# EAGLE schematic setup (EAGLE 7.7.0)
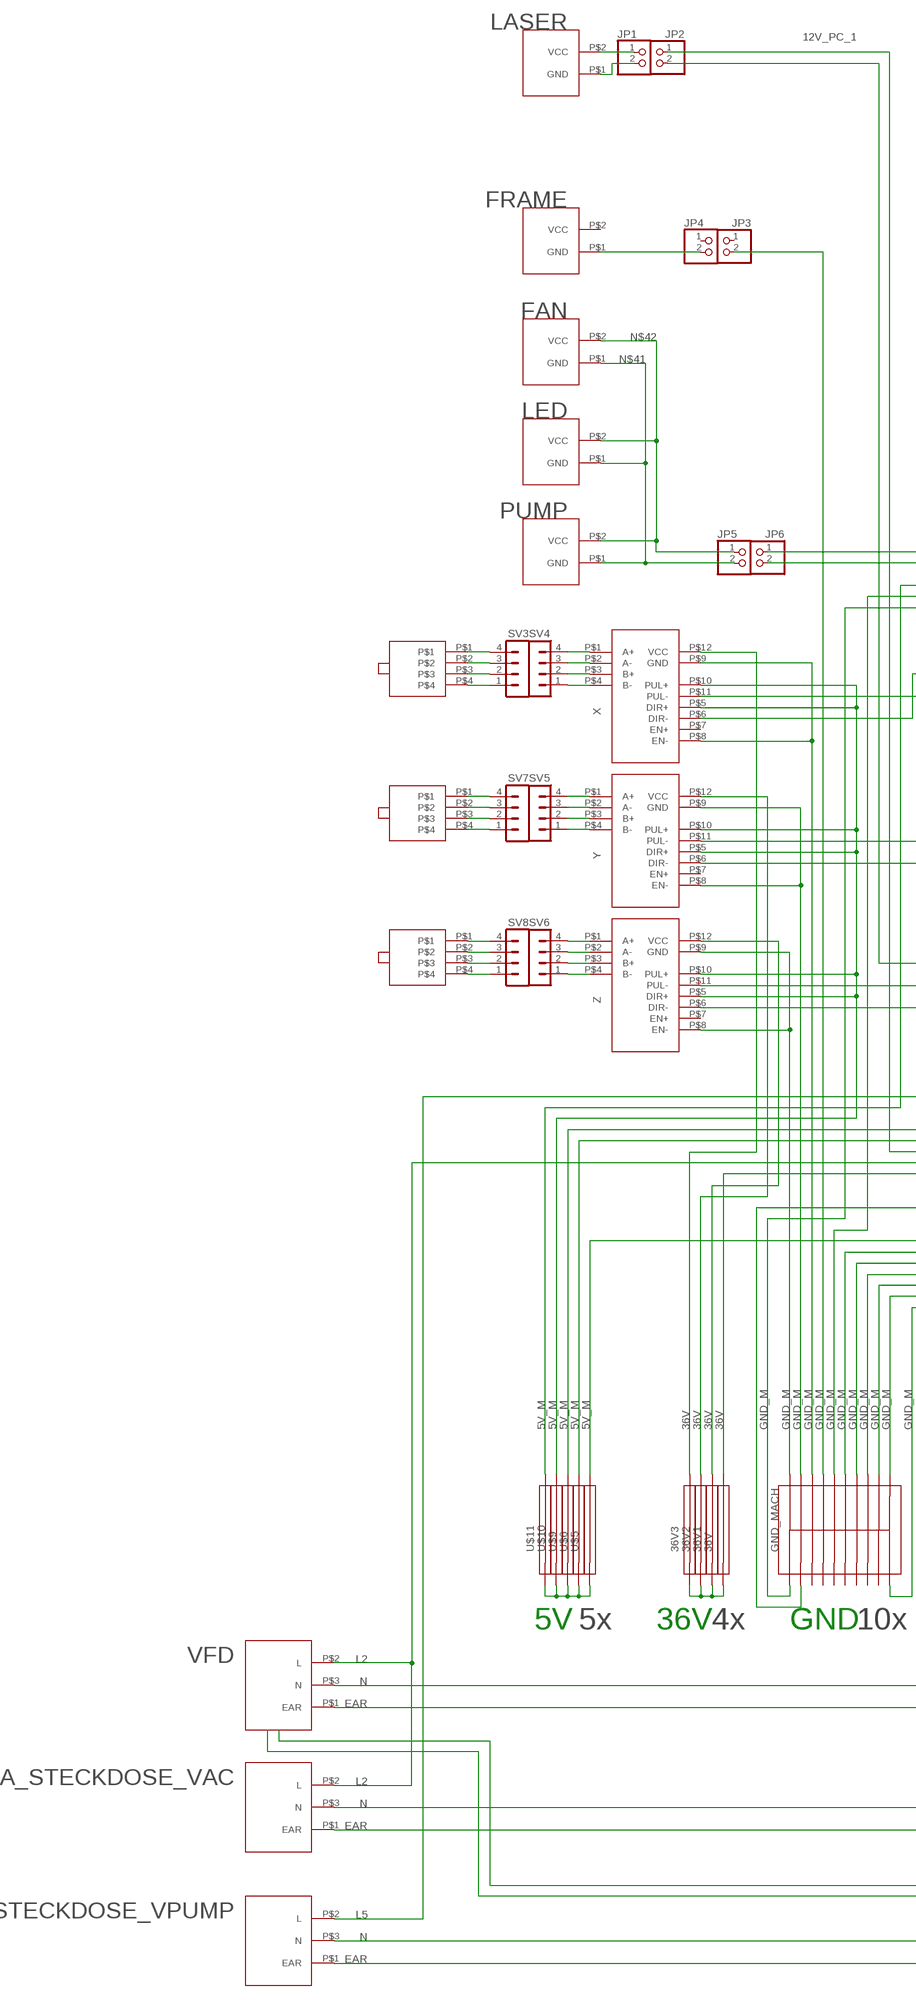
[diagram p0: schematic, sheet 1, part 1 of 3]
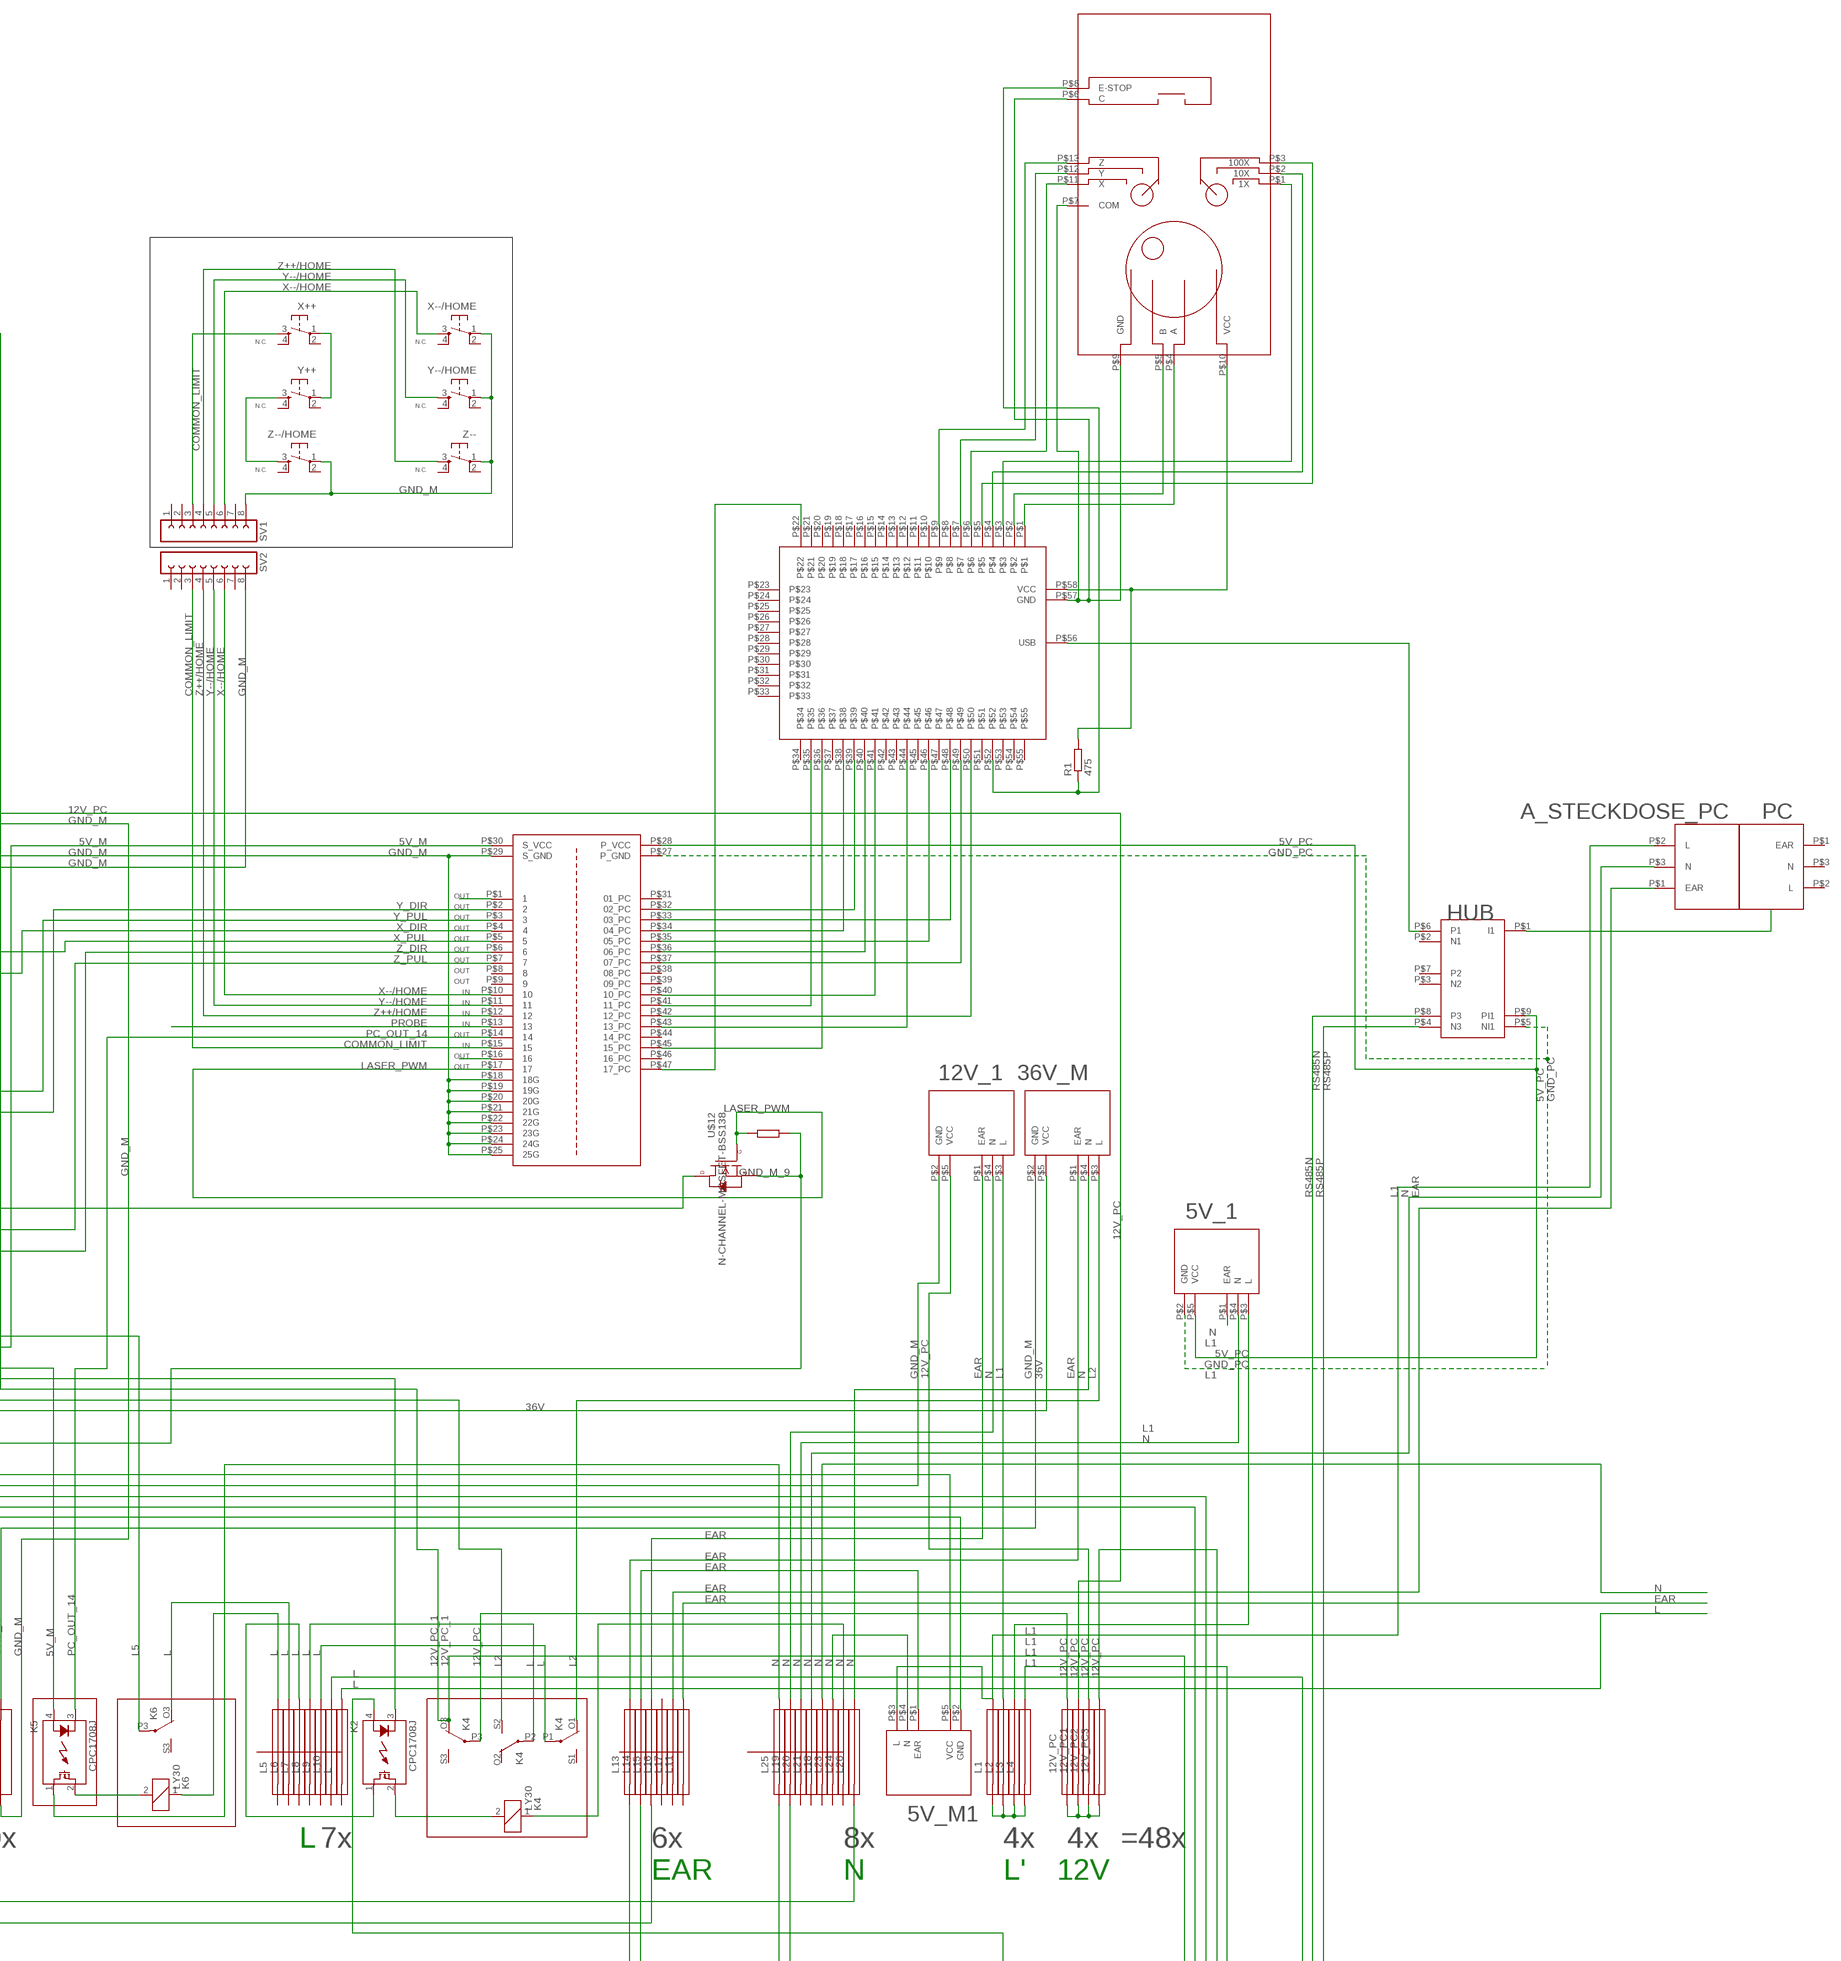
[diagram p1: schematic, sheet 1, part 2 of 3]
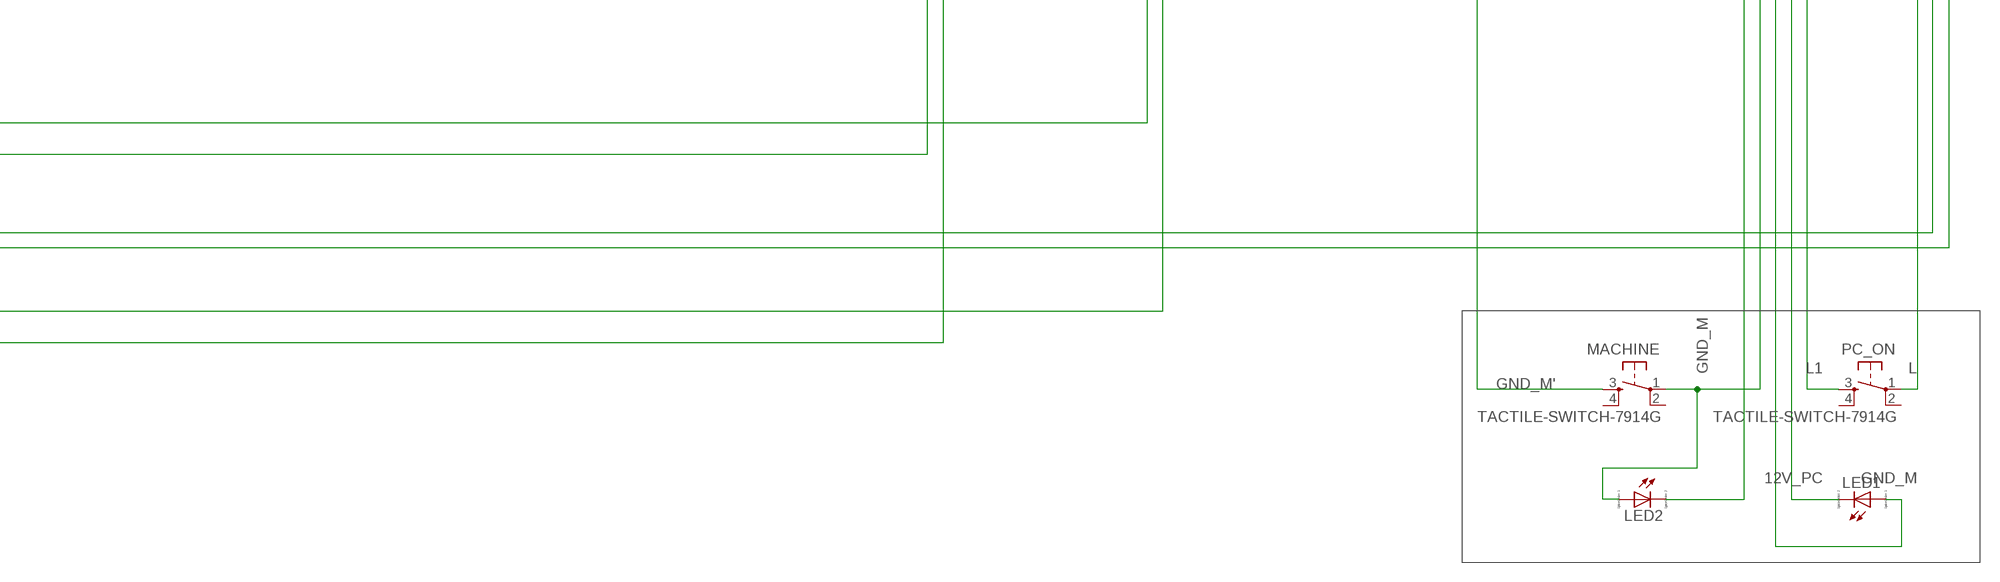
[diagram p2: schematic, sheet 1, part 3 of 3]

## Parts
5V_1  PWR  [PWR]
5V_M1  PWR  [PWR]
12V_1  PWR  [PWR]
12V_PC  SINGLE_CONNECTOR  [CONNECTOR]
12V_PC1  SINGLE_CONNECTOR  [CONNECTOR]
12V_PC2  SINGLE_CONNECTOR  [CONNECTOR]
12V_PC3  SINGLE_CONNECTOR  [CONNECTOR]
36V  SINGLE_CONNECTOR  [CONNECTOR]
36V1  SINGLE_CONNECTOR  [CONNECTOR]
36V2  SINGLE_CONNECTOR  [CONNECTOR]
36V3  SINGLE_CONNECTOR  [CONNECTOR]
36V_M  PWR  [PWR]
A_STECKDOSE_PC  230VDEV  [230V]
A_STECKDOSE_VAC  230VDEV  [230V]
A_STECKDOSE_VPUMP  230VDEV  [230V]
FAN  LV_DEV  [PUMP]
FRAME  LV_DEV  [PUMP]
GND_MACH  CONNECTOR  [CONNECTOR]
JP1  PINHD-1X2  [1X02]
JP2  PINHD-1X2  [1X02]
JP3  PINHD-1X2  [1X02]
JP4  PINHD-1X2  [1X02]
JP5  PINHD-1X2  [1X02]
JP6  PINHD-1X2  [1X02]
K2  CPC1708J  [I4-PAC]
K4  LY30  [LY30]
K5  CPC1708J  [I4-PAC]
K6  LY30  [LY30]
L  SINGLE_CONNECTOR  [CONNECTOR]
L1  SINGLE_CONNECTOR  [CONNECTOR]
L2  SINGLE_CONNECTOR  [CONNECTOR]
L3  SINGLE_CONNECTOR  [CONNECTOR]
L4  SINGLE_CONNECTOR  [CONNECTOR]
L5  SINGLE_CONNECTOR  [CONNECTOR]
L6  SINGLE_CONNECTOR  [CONNECTOR]
L7  SINGLE_CONNECTOR  [CONNECTOR]
L8  SINGLE_CONNECTOR  [CONNECTOR]
L9  SINGLE_CONNECTOR  [CONNECTOR]
L10  SINGLE_CONNECTOR  [CONNECTOR]
L11  SINGLE_CONNECTOR  [CONNECTOR]
L13  SINGLE_CONNECTOR  [CONNECTOR]
L14  SINGLE_CONNECTOR  [CONNECTOR]
L15  SINGLE_CONNECTOR  [CONNECTOR]
L16  SINGLE_CONNECTOR  [CONNECTOR]
L17  SINGLE_CONNECTOR  [CONNECTOR]
L18  SINGLE_CONNECTOR  [CONNECTOR]
L19  SINGLE_CONNECTOR  [CONNECTOR]
L20  SINGLE_CONNECTOR  [CONNECTOR]
L21  SINGLE_CONNECTOR  [CONNECTOR]
L23  SINGLE_CONNECTOR  [CONNECTOR]
L24  SINGLE_CONNECTOR  [CONNECTOR]
L25  SINGLE_CONNECTOR  [CONNECTOR]
L26  SINGLE_CONNECTOR  [CONNECTOR]
LASER  LV_DEV  [PUMP]
LED  LV_DEV  [PUMP]
LED1  LED_E  [LED_1206]
LED2  LED_E  [LED_1206]
MACHINE  TACTILE-SWITCH-7914G  [7914G]
PC  230VDEV  [230V]
PC_ON  TACTILE-SWITCH-7914G  [7914G]
PUMP  LV_DEV  [PUMP]
R1  475  R-EU_0204/2V  [0204V]
SV1  FE08-1  [FE08]
SV2  FE08-1  [FE08]
SV3  MA04-1  [MA04-1]
SV4  MA04-1  [MA04-1]
SV5  MA04-1  [MA04-1]
SV6  MA04-1  [MA04-1]
SV7  MA04-1  [MA04-1]
SV8  MA04-1  [MA04-1]
U$1  BOB  [BOB]
U$2  HUB  [HUB]
U$3  MOTOR  [MOTOR]
U$4  POKEY57U  [POKEY57U]
U$5  SINGLE_CONNECTOR  [CONNECTOR]
U$6  SINGLE_CONNECTOR  [CONNECTOR]
U$7  MOTOR  [MOTOR]
U$8  MOTOR  [MOTOR]
U$9  SINGLE_CONNECTOR  [CONNECTOR]
U$10  SINGLE_CONNECTOR  [CONNECTOR]
U$11  SINGLE_CONNECTOR  [CONNECTOR]
U$12  N-CHANNEL-MOSFET-BSS138  [SOT23-3]
U$13  PENDANT  [PENDANT]
VFD  230VDEV  [230V]
X  DRIVER  [DRIVER]
X++  TACTILE-SWITCH-7914G  [7914G]
X--/HOME  TACTILE-SWITCH-7914G  [7914G]
Y  DRIVER  [DRIVER]
Y++  TACTILE-SWITCH-7914G  [7914G]
Y--/HOME  TACTILE-SWITCH-7914G  [7914G]
Z  DRIVER  [DRIVER]
Z--  TACTILE-SWITCH-7914G  [7914G]
Z--/HOME  TACTILE-SWITCH-7914G  [7914G]

## Nets
5V_M: 5V_M1.P$5(VCC) K2.3(K) K5.4(A) U$1.P$30(S_VCC) U$5.P$2 U$6.P$2 U$9.P$2 U$10.P$2 U$11.P$2 X.P$5(DIR+) X.P$10(PUL+) Y.P$5(DIR+) Y.P$10(PUL+) Z.P$5(DIR+) Z.P$10(PUL+)
5V_PC: 5V_1.P$5(VCC) U$1.P$28(P_VCC) U$2.P$6(P1) U$2.P$9(PI1) U$4.P$56(USB)
12V_PC: 12V_1.P$5(VCC) 12V_PC1.P$2 12V_PC2.P$2 12V_PC3.P$2 12V_PC.P$2 JP6.1 K4.P3(4:P) LED1.C
12V_PC_1: JP2.1 K4.O3(4:O) LED2.C
36V: 36V1.P$2 36V2.P$2 36V3.P$2 36V.P$2 36V_M.P$5(VCC) X.P$12(VCC) Y.P$12(VCC) Z.P$12(VCC)
COMMON_LIMIT: SV1.3 SV2.3 U$1.P$15 X++.3
EAR: 5V_M1.P$1(EAR) 12V_1.P$1(EAR) 36V_M.P$1(EAR) A_STECKDOSE_PC.P$1(EAR) A_STECKDOSE_VAC.P$1(EAR) A_STECKDOSE_VPUMP.P$1(EAR) L11.P$2 L13.P$1 L13.P$2 L14.P$1 L14.P$2 L15.P$1 L15.P$2 L17.P$2 VFD.P$1(EAR)
GND_M: 5V_M1.P$2(GND) 12V_1.P$2(GND) 36V_M.P$2(GND) GND_MACH.P$1 GND_MACH.P$10 GND_MACH.P$11 GND_MACH.P$12 GND_MACH.P$13 GND_MACH.P$14 GND_MACH.P$15 GND_MACH.P$16 GND_MACH.P$17 GND_MACH.P$18 GND_MACH.P$19 GND_MACH.P$20 JP3.2 JP6.2 LED1.A LED2.A MACHINE.1 SV1.8 SV2.8 U$1.P$18(18G) U$1.P$19(19G) U$1.P$20(20G) U$1.P$21(21G) U$1.P$22(22G) U$1.P$23(23G) U$1.P$24(24G) U$1.P$25(25G) U$1.P$29(S_GND) X--/HOME.1 X.P$8(EN-) X.P$9(GND) Y--/HOME.1 Y.P$8(EN-) Y.P$9(GND) Z--.1 Z--/HOME.1 Z.P$8(EN-) Z.P$9(GND)
GND_M': K2.4(A) MACHINE.3
GND_M_9: GND_MACH.P$2 U$12.2(S)
GND_PC: 5V_1.P$2(GND) U$1.P$27(P_GND) U$2.P$5(NI1)
L: K2.1(DS1) K4.P1(2:P) K4.P2(3:P) K6.1 K6.O3(4:O) L5.P$2 L6.P$2 L7.P$2 L8.P$2 L9.P$2 L10.P$2 L.P$2 PC_ON.1
L1: 5V_1.P$3(L) 5V_M1.P$3(L) 12V_1.P$3(L) A_STECKDOSE_PC.P$2(L) L1.P$2 L2.P$2 L3.P$2 L4.P$2 PC_ON.3
L2: 36V_M.P$3(L) A_STECKDOSE_VAC.P$2(L) K4.O1(2:O) K4.S2(3:S) VFD.P$2(L)
L5: A_STECKDOSE_VPUMP.P$2(L) K6.P3(4:P)
LASER_PWM: U$1.P$17 U$12.1(G)
N: 5V_1.P$4(N) 5V_M1.P$4(N) 12V_1.P$4(N) 36V_M.P$4(N) A_STECKDOSE_PC.P$3(N) A_STECKDOSE_VAC.P$3(N) A_STECKDOSE_VPUMP.P$3(N) K4.1 K5.1(DS1) L18.P$2 L19.P$1 L19.P$2 L20.P$2 L21.P$2 L23.P$2 L24.P$2 L25.P$1 L25.P$2 L26.P$1 L26.P$2 VFD.P$3(N)
N$1: SV3.4 U$3.P$1
N$2: SV3.3 U$3.P$2
N$3: SV3.2 U$3.P$3
N$4: SV3.1 U$3.P$4
N$5: SV7.4 U$7.P$1
N$6: SV7.3 U$7.P$2
N$7: SV7.2 U$7.P$3
N$8: SV8.4 U$8.P$1
N$9: SV8.3 U$8.P$2
N$10: SV8.2 U$8.P$3
N$11: SV8.1 U$8.P$4
N$12: SV7.1 U$7.P$4
N$13: U$1.P$1
N$14: U$1.P$16
N$15: U$1.P$33(03_PC) U$4.P$48
N$16: JP2.2 U$12.3(D)
N$17: U$1.P$40(10_PC) U$4.P$41
N$18: X++.1 Y++.1
N$19: U$1.P$47(17_PC) U$4.P$22
N$20: U$1.P$32(02_PC) U$4.P$39
N$21: U$2.P$1(I1)
N$22: Y++.3 Z--/HOME.3
N$23: U$1.P$34(04_PC) U$4.P$38
N$24: U$1.P$35(05_PC) U$4.P$46
N$25: SV4.4 X.P$1(A+)
N$26: SV4.3 X.P$2(A-)
N$27: U$1.P$36(06_PC) U$4.P$40
N$28: SV4.2 X.P$3(B+)
N$29: SV4.1 X.P$4(B-)
N$30: SV5.4 Y.P$1(A+)
N$31: SV5.3 Y.P$2(A-)
N$32: SV5.2 Y.P$3(B+)
N$33: SV5.1 Y.P$4(B-)
N$34: SV6.4 Z.P$1(A+)
N$35: SV6.3 Z.P$2(A-)
N$36: SV6.2 Z.P$3(B+)
N$37: SV6.1 Z.P$4(B-)
N$38: JP1.2 LASER.P$1(GND)
N$39: JP1.1 LASER.P$2(VCC)
N$40: FRAME.P$1(GND) JP4.2
N$41: FAN.P$1(GND) JP5.2 LED.P$1(GND) PUMP.P$1(GND)
N$42: FAN.P$2(VCC) JP5.1 LED.P$2(VCC) PUMP.P$2(VCC)
N$43: K5.2(DS2) K6.2
N$44: 5V_1.P$1(EAR)
N$45: U$1.P$37(07_PC) U$4.P$49
N$46: K2.2(DS2) K4.2
N$47: 12V_PC1.P$1 12V_PC2.P$1 12V_PC3.P$1 12V_PC.P$1
N$48: U$4.P$57(GND) U$13.P$6(C) U$13.P$7(COM) U$13.P$9(GND)
N$49: L1.P$1 L2.P$1 L3.P$1 L4.P$1
N$50: 36V1.P$1 36V2.P$1 36V3.P$1 36V.P$1
N$51: R1.2 U$4.P$58(VCC) U$13.P$10(VCC)
N$52: U$4.P$1 U$13.P$4(A)
N$53: U$4.P$2 U$13.P$5(B)
N$54: U$4.P$5 U$13.P$3(100X)
N$55: U$4.P$4 U$13.P$2(10X)
N$56: U$4.P$3 U$13.P$1(1X)
N$57: U$5.P$1 U$6.P$1 U$9.P$1 U$10.P$1 U$11.P$1
N$58: U$1.P$41(11_PC) U$4.P$35
N$59: U$1.P$42(12_PC) U$4.P$50
N$60: U$1.P$43(13_PC) U$4.P$44
N$61: U$1.P$45(15_PC) U$4.P$36
N$64: U$4.P$6 U$13.P$11(X)
N$65: U$4.P$7 U$13.P$12(Y)
N$66: U$4.P$9 U$13.P$13(Z)
N$68: R1.1 U$4.P$52 U$13.P$8(E-STOP)
PC_OUT_14: K5.3(K) U$1.P$14
PROBE: U$1.P$13
RS485N: U$2.P$8(P3)
RS485P: U$2.P$4(N3)
X--/HOME: SV1.6 SV2.6 U$1.P$10 X--/HOME.3
X_DIR: U$1.P$4 X.P$6(DIR-)
X_PUL: U$1.P$5 X.P$11(PUL-)
Y--/HOME: SV1.5 SV2.5 U$1.P$11 Y--/HOME.3
Y_DIR: U$1.P$2 Y.P$6(DIR-)
Y_PUL: U$1.P$3 Y.P$11(PUL-)
Z++/HOME: SV1.4 SV2.4 U$1.P$12 Z--.3
Z_DIR: U$1.P$6 Z.P$6(DIR-)
Z_PUL: U$1.P$7 Z.P$11(PUL-)
Unconnected: FRAME.P$2(VCC) GND_MACH.P$3 GND_MACH.P$4 GND_MACH.P$5 GND_MACH.P$6 GND_MACH.P$7 GND_MACH.P$8 GND_MACH.P$9 JP3.1 JP4.1 K4.O2(3:O) K4.S1(2:S) K4.S3(4:S) K6.O1(2:O) K6.O2(3:O) K6.P1(2:P) K6.P2(3:P) K6.S1(2:S) K6.S2(3:S) K6.S3(4:S) L5.P$1 L6.P$1 L7.P$1 L8.P$1 L9.P$1 L10.P$1 L11.P$1 L16.P$1 L16.P$2 L17.P$1 L18.P$1 L20.P$1 L21.P$1 L23.P$1 L24.P$1 L.P$1 MACHINE.2 MACHINE.4 PC.P$1(EAR) PC.P$2(L) PC.P$3(N) PC_ON.2 PC_ON.4 SV1.1 SV1.2 SV1.7 SV2.1 SV2.2 SV2.7 U$1.P$8 U$1.P$9 U$1.P$31(01_PC) U$1.P$38(08_PC) U$1.P$39(09_PC) U$1.P$44(14_PC) U$1.P$46(16_PC) U$2.P$2(N1) U$2.P$3(N2) U$2.P$7(P2) U$4.P$8 U$4.P$10 U$4.P$11 U$4.P$12 U$4.P$13 U$4.P$14 U$4.P$15 U$4.P$16 U$4.P$17 U$4.P$18 U$4.P$19 U$4.P$20 U$4.P$21 U$4.P$23 U$4.P$24 U$4.P$25 U$4.P$26 U$4.P$27 U$4.P$28 U$4.P$29 U$4.P$30 U$4.P$31 U$4.P$32 U$4.P$33 U$4.P$34 U$4.P$37 U$4.P$42 U$4.P$43 U$4.P$45 U$4.P$47 U$4.P$51 U$4.P$53 U$4.P$54 U$4.P$55 X++.2 X++.4 X--/HOME.2 X--/HOME.4 X.P$7(EN+) Y++.2 Y++.4 Y--/HOME.2 Y--/HOME.4 Y.P$7(EN+) Z--.2 Z--.4 Z--/HOME.2 Z--/HOME.4 Z.P$7(EN+)

## Notes on the sheet
- N.C. | N.C.
- N.C. | N.C.
- N.C. | N.C.
- OUT
- OUT
- OUT
- OUT
- OUT
- OUT
- OUT
- OUT
- OUT
- IN
- IN
- IN
- IN
- OUT
- IN
- OUT
- OUT
- 5V | 5x | 36V | 4x | GND | 10x | L | 7x | 6x | 8x | 4x | 4x | =48x
- EAR | N | L' | 12V

## Library data of the parts
5V_1 5V_M1 12V_1 36V_M = libliblib:PWR
12V_PC 12V_PC1-12V_PC3 36V 36V1-36V3 L L1-L11 L13-L21 L23-L26 U$5 U$6 U$9-U$11 = libliblib:SINGLE_CONNECTOR
A_STECKDOSE_PC A_STECKDOSE_VAC A_STECKDOSE_VPUMP PC VFD = libliblib:230VDEV
FAN FRAME LASER LED PUMP = libliblib:LV_DEV
GND_MACH = libliblib:CONNECTOR
JP1-JP6 = pinhead:PINHD-1X2: PIN HEADER
K2 K5 = relay:CPC1708J: Single-Pole, Normally Open i4-PAC (TM) DC Power Relay Source: Data sheet <http://www.clare.com/home/pdfs.nsf/www/CPC1708.pdf/$file/CPC1708.pdf>
K4 K6 = relay:LY30: RELAY 3 x switch, Omron; OC_FARNELL: unknown; OC_NEWARK: unknown
LED1 LED2 = eagle-ltspice:LED_E: LED Source: http://www.osram.convergy.de Source: www.luxeon.com Source: www.kingbright.com; SPICEMODEL: NONE; SPICEPREFIX: D; SPICETYPE: diode
MACHINE PC_ON X++ X--/HOME Y++ Y--/HOME Z-- Z--/HOME = GeekAmmo:TACTILE-SWITCH: Tactile Switch 4 Pins, SPST NO
R1 = rcl:R-EU_: RESISTOR, European symbol
SV1 SV2 = con-lsta:FE08-1: FEMALE HEADER; OC_FARNELL: unknown; OC_NEWARK: unknown
SV3-SV8 = con-lstb:MA04-1: PIN HEADER; OC_FARNELL: unknown; OC_NEWARK: unknown
U$1 = libliblib:BOB
U$2 = libliblib:HUB
U$3 U$7 U$8 = libliblib:MOTOR
U$4 = libliblib:POKEY57U
U$12 = GeekAmmo:N-CHANNEL-MOSFET: N-Channel MOSFET Mode Field Effect Transistor; DATASHEET: http://www.fairchildsemi.com/ds/BS/BSS138.pdf; DIGIKEY: BSS138TR-ND; ELEMENT14: 2323154; URL: http://au.element14.com/fairchild-semiconductor/bss138/mosfet-n-ch-50v-220ma-sot-23/dp/2323154
U$13 = libliblib:PENDANT
X Y Z = libliblib:DRIVER